# EAGLE design iRepair (EAGLE 7.3.0)
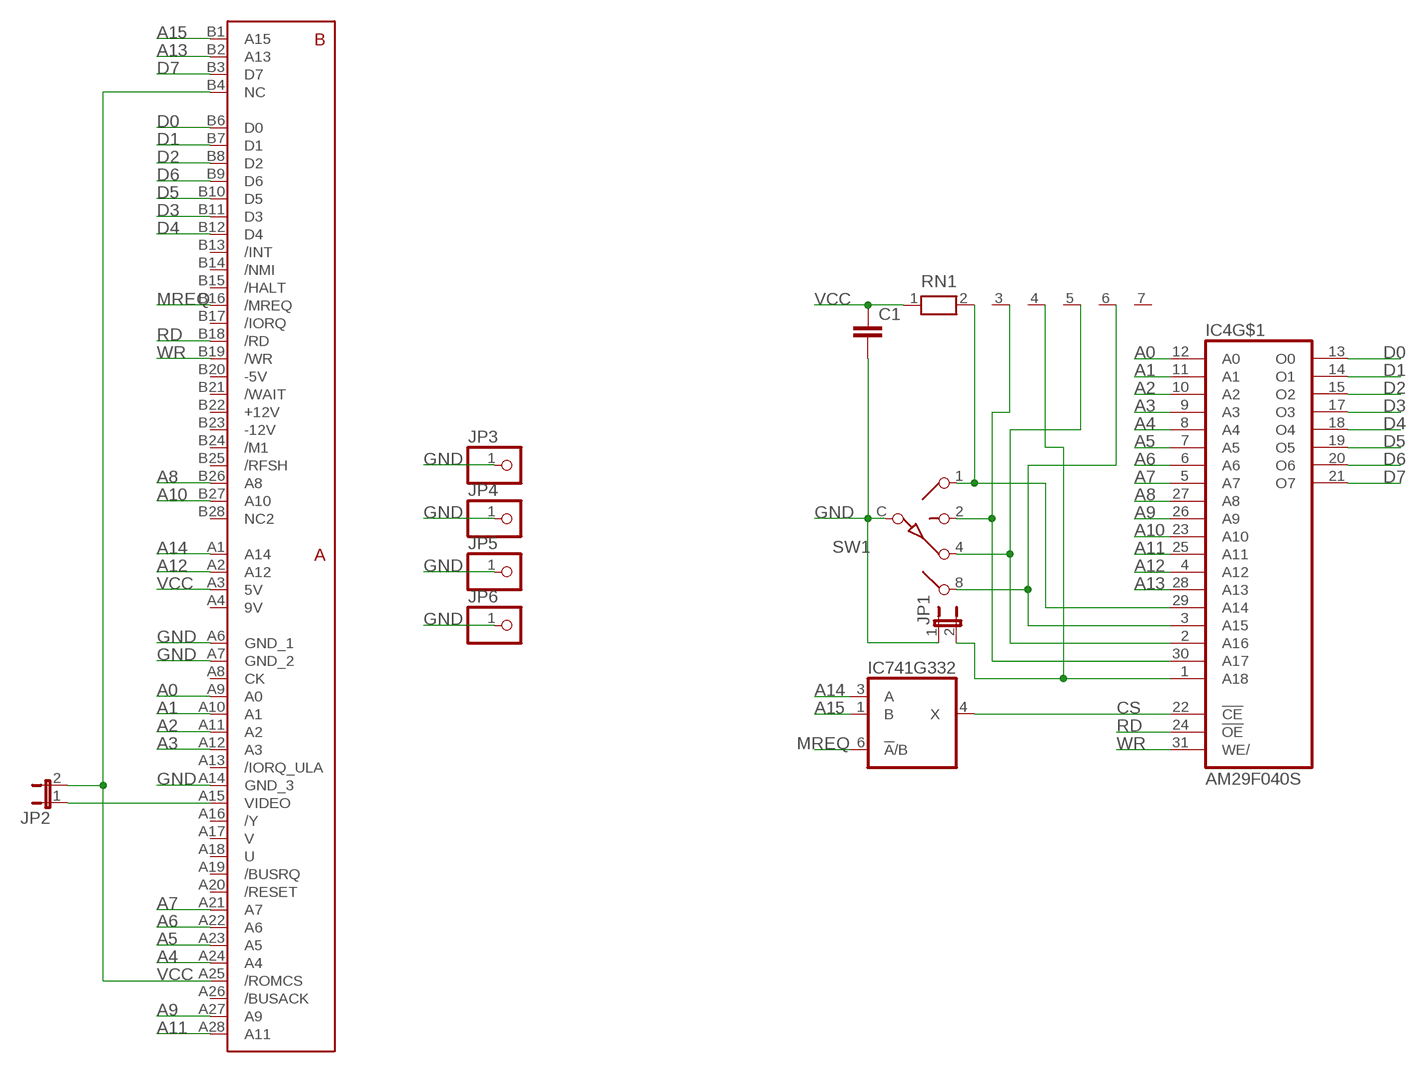
[diagram p0: schematic, sheet 1]

## Parts
C1  C-EU025-025X050  [C025-025X050]
IC4  AM29F040S  [PLCC-SR32]
IC741G332  741G3157DBVR  [DBV_R-PDSO-G6]
JP1  JP1E  [JP1]
JP2  JP1E  [JP1]
JP3  PINHD-1X1  [1X01]
JP4  PINHD-1X1  [1X01]
JP5  PINHD-1X1  [1X01]
JP6  PINHD-1X1  [1X01]
RN1  RN06  [RN-7]
SW1  SW-C16  [SW-C16]
U$3  ZXSP_ED2X28_SPE  [2X28_SPE]

## Nets
A0: IC4.12(A0) U$3.A9(A0)
A1: IC4.11(A1) U$3.A10(A1)
A2: IC4.10(A2) U$3.A11(A2)
A3: IC4.9(A3) U$3.A12(A3)
A4: IC4.8(A4) U$3.A24(A4)
A5: IC4.7(A5) U$3.A23(A5)
A6: IC4.6(A6) U$3.A22(A6)
A7: IC4.5(A7) U$3.A21(A7)
A8: IC4.27(A8) U$3.B26(A8)
A9: IC4.26(A9) U$3.A27(A9)
A10: IC4.23(A10) U$3.B27(A10)
A11: IC4.25(A11) U$3.A28(A11)
A12: IC4.4(A12) U$3.A2(A12)
A13: IC4.28(A13) U$3.B2(A13)
A14: IC741G332.3(A) U$3.A1(A14)
A15: IC741G332.1(B) U$3.B1(A15)
CS: IC4.22(!CE) IC741G332.4(X)
D0: IC4.13(O0) U$3.B6(D0)
D1: IC4.14(O1) U$3.B7(D1)
D2: IC4.15(O2) U$3.B8(D2)
D3: IC4.17(O3) U$3.B11(D3)
D4: IC4.18(O4) U$3.B12(D4)
D5: IC4.19(O5) U$3.B10(D5)
D6: IC4.20(O6) U$3.B9(D6)
D7: IC4.21(O7) U$3.B3(D7)
GND: C1.2 JP1.1 JP3.1 JP4.1 JP5.1 JP6.1 SW1.C U$3.A6(GND_1) U$3.A7(GND_2) U$3.A14(GND_3)
MREQ: IC741G332.6(!A!/B) U$3.B16(/MREQ)
N$1: JP2.1 U$3.A15(VIDEO)
N$2: IC4.1(A18) JP1.2 RN1.4
N$3: IC4.30(A17) RN1.3 SW1.2
N$4: IC4.2(A16) RN1.5 SW1.4
N$5: IC4.3(A15) RN1.6 SW1.8
N$6: IC4.29(A14) RN1.2 SW1.1
RD: IC4.24(!OE) U$3.B18(/RD)
VCC: C1.1 JP2.2 RN1.1 U$3.A3(5V) U$3.A25(/ROMCS) U$3.B4(NC)
WR: IC4.31(WE/) U$3.B19(/WR)
Unconnected: RN1.7 U$3.A8(CK) U$3.A13(/IORQ_ULA) U$3.A16(/Y) U$3.A17(V) U$3.A18(U) U$3.A19(/BUSRQ) U$3.A20(/RESET) U$3.A26(/BUSACK) U$3.B13(/INT) U$3.B14(/NMI) U$3.B15(/HALT) U$3.B17(/IORQ) U$3.B21(/WAIT) U$3.B24(/M1) U$3.B25(/RFSH) U$3.B28(NC2)

## Power pins joined to a net without a drawn wire
9V: U$3.A4(9V)
+12V: U$3.B22(+12V)
-5V: U$3.B20(-5V)
-12V: U$3.B23(-12V)
GND: IC4.16(GND) IC741G332.2(GND)
VCC: IC4.32(VCC) IC741G332.5(VCC)

## Library data of the parts
C1 = rcl:C-EU: CAPACITOR, European symbol
IC4 = am29-memory:AM29F040S
IC741G332 = 74xx-little-de:74*1G3157: Single-Pole, Double-Throw Analog Switch Source: http://focus.ti.com/lit/ds/symlink/sn74lvc1g3157.pdf
JP1 JP2 = jumper:JP1E: JUMPER
JP3-JP6 = pinhead:PINHD-1X1: PIN HEADER
RN1 = resistor-net:RN06: RESISTOR NETWORK; OC_FARNELL: unknown; OC_NEWARK: unknown
SW1 = special:SW-C16: SWITCH 16-step rotary switch
U$3 = zx_edge:ZXSP_ED

## Board
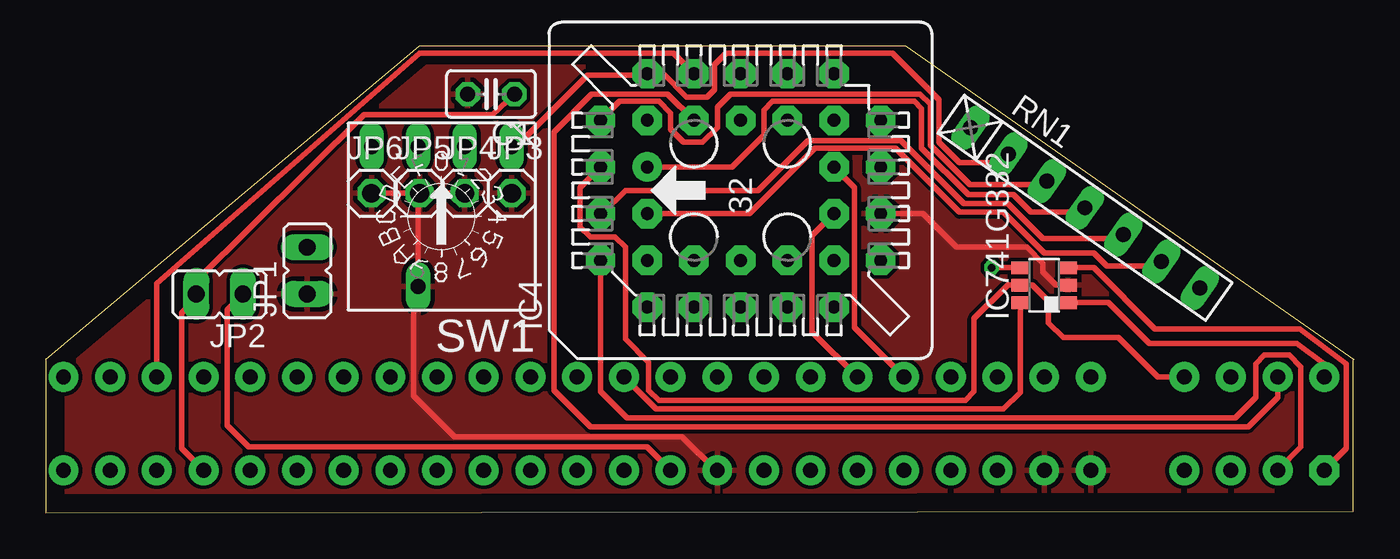
[diagram p1: board, top side]
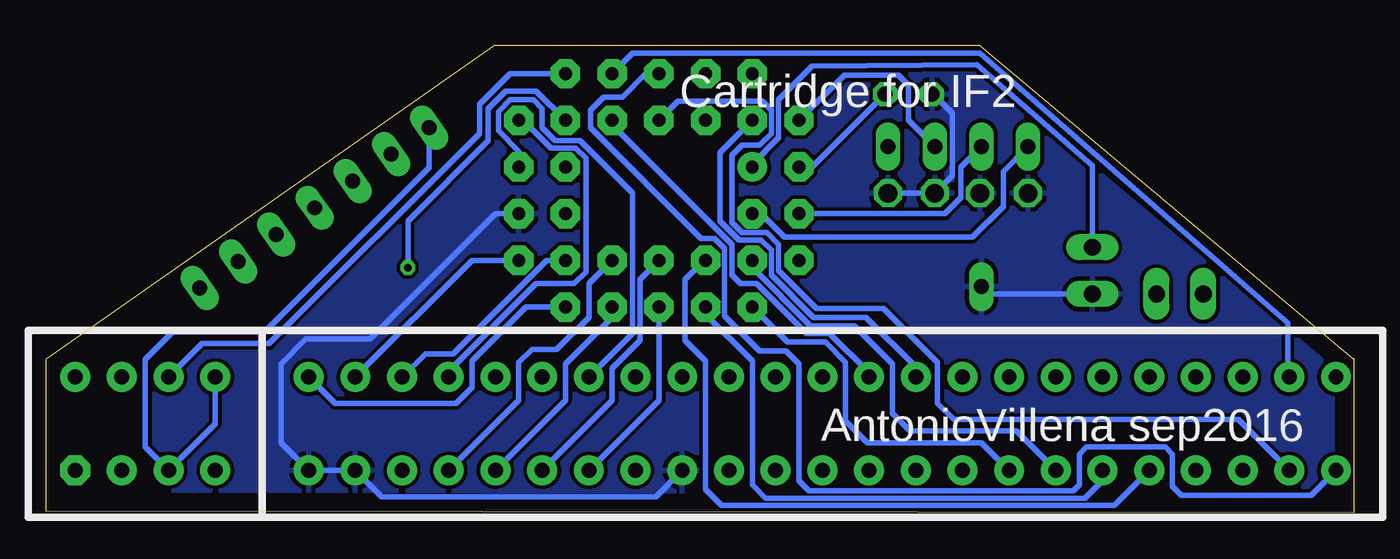
[diagram p2: board, bottom side, seen from below]

Size 71.12 x 25.4 mm. Coordinates in mm from the lower left corner, seen from the top.
Outline: 71.1,8.32 71.1,0.08 0,0 0,8.33
Outline: 0,8.4 0,8.33
Outline: 0,8.33 20.32,25.4 46.75,25.4 71.12,8.33
Copper layers (1*16): Top 0.035mm / dielectric 1.5mm / Bottom 0.035mm
Design rules "default": minimum track width 10mil, minimum drill 24mil, track to track 8mil, track to pad 8mil, pad to pad 8mil, via to via 8mil, smd to smd 8mil, copper to edge 40mil, drill to drill 8mil, minimum pad ring 10mil, minimum via ring 8mil, stop-mask expansion 4mil, vias tented up to drill 0mil, thermal gap 10mil

### Footprints (pad centres in the part's own frame; a part is rotated, then mirrored left to right if it is on the bottom)
C025-025X050 = drill 0.813 octagon: 1 -1.27,0; 2 1.27,0
PLCC-SR32 = drill 0.7 pad 1.6: 1 1.27,5.08 | drill 0.7 pad 1.6 octagon: 2 -1.27,7.62; 3 -1.27,5.08; 4 -3.81,7.62; 5 -6.35,5.08; 6 -3.81,5.08; 7 -6.35,2.54; 8 -3.81,2.54; 9 -6.35,0; 10 -3.81,0; 11 -6.35,-2.54; 12 -3.81,-2.54; 13 -6.35,-5.08; 14 -3.81,-7.62; 15 -3.81,-5.08; 16 -1.27,-7.62; 17 -1.27,-5.08; 18 1.27,-7.62; 19 1.27,-5.08; 20 3.81,-7.62; 21 6.35,-5.08; 22 3.81,-5.08; 23 6.35,-2.54; 24 3.81,-2.54; 25 6.35,0; 26 3.81,0; 27 6.35,2.54; 28 3.81,2.54; 29 6.35,5.08; 30 3.81,7.62; 31 3.81,5.08; 32 1.27,7.62
DBV_R-PDSO-G6 = smd 0.69 x 0.99: 1 -0.95,-1.29; 2 0,-1.29; 3 0.95,-1.29; 4 0.95,1.3; 5 0,1.3; 6 -0.95,1.3
JP1 = drill 0.914 long: 1 0,-1.27; 2 0,1.27
1X01 = drill 1.016 octagon: 1 0,0
RN-7 = drill 0.813 long: 1 -7.62,0; 2 -5.08,0; 3 -2.54,0; 4 0,0; 5 2.54,0; 6 5.08,0; 7 7.62,0
SW-C16 = drill 0.813 long: 1 -3.81,-3.81; 2 -1.27,-3.81; 4 1.27,-3.81; 8 3.81,-3.81; C 1.27,3.81
2X28_SPE = drill 0.813 pad 1.626 octagon: A1 0,-5.08 | drill 0.813 pad 1.626: A2 2.54,-5.08; A3 5.08,-5.08; A4 7.62,-5.08; A6 12.7,-5.08; A7 15.24,-5.08; A8 17.78,-5.08; A9 20.32,-5.08; A10 22.86,-5.08; A11 25.4,-5.08; A12 27.94,-5.08; A13 30.48,-5.08; A14 33.02,-5.08; A15 35.56,-5.08; A16 38.1,-5.08; A17 40.64,-5.08; A18 43.18,-5.08; A19 45.72,-5.08; A20 48.26,-5.08; A21 50.8,-5.08; A22 53.34,-5.08; A23 55.88,-5.08; A24 58.42,-5.08; A25 60.96,-5.08; A26 63.5,-5.08; A27 66.04,-5.08; A28 68.58,-5.08; B1 0,0; B2 2.54,0; B3 5.08,0; B4 7.62,0; B6 12.7,0; B7 15.24,0; B8 17.78,0; B9 20.32,0; B10 22.86,0; B11 25.4,0; B12 27.94,0; B13 30.48,0; B14 33.02,0; B15 35.56,0; B16 38.1,0; B17 40.64,0; B18 43.18,0; B19 45.72,0; B20 48.26,0; B21 50.8,0; B22 53.34,0; B23 55.88,0; B24 58.42,0; B25 60.96,0; B26 63.5,0; B27 66.04,0; B28 68.58,0

### Placement (x,y rotation side)
C1  24.21,22.78 180 top
IC4  37.78,17.54 90 top
IC741G332  54.29,12.38 90 top
JP1  14.21,13.18 0 top
JP2  9.45,11.91 90 top
JP3  25.32,17.38 0 top
JP4  22.78,17.38 0 top
JP5  20.32,17.38 0 top
JP6  17.7,17.38 0 top
RN1  56.52,16.59 325 top
SW1  21.51,16.11 180 top
U$3  69.53,7.38 0 bottom

### Tracks (layer width: path | path; a pad name or v marks a point on that pad's centre or on a via)
A0
  Bottom 0.305: IC4.12 41.59,12.46 41.59,10.64 43.34,8.89 44.69,8.89 45.4,8.18 45.4,6.11 U$3.A9
A1
  Bottom 0.305: IC4.11 40.32,10.64 42.86,8.1 42.86,6.11 U$3.A10
A2
  Bottom 0.305: IC4.10 38.81,12.7 38.81,9.37 40.32,7.86 40.32,6.11 U$3.A11
A3
  Bottom 0.305: IC4.9 37.78,6.11 U$3.A12
A4
  Bottom 0.305: IC4.8 35.32,13.73 36.35,12.7 36.35,9.37 35.24,8.26 35.24,1.27 34.37,0.4 13.02,0.4 U$3.A24
A5
  Bottom 0.305: IC4.7 35.24,10.79 32.7,8.26 32.7,1.51 31.99,0.79 14.61,0.79 13.65,1.75 U$3.A23
A6
  Bottom 0.305: IC4.6 32.7,13.34 29.53,10.16 27.15,10.16 25.08,8.1 25.08,5.4 24.13,4.45 18.34,4.45 U$3.A22
A7
  Bottom 0.305: U$3.A21 20.24,3.81 26.43,3.81 27.62,5 27.62,8.18 28.73,9.29 30.8,9.29 IC4.5
A8
  Top 0.305: IC4.27 34.13,25 20.32,25 6.03,12.46 U$3.B26
A9
  Bottom 0.305: IC4.26 36.75,22.38 32.15,22.38 31.67,21.91 31.67,20.64 32.31,20 33.26,20 33.81,19.45 33.81,15.8 33.26,15.24 31.91,15.24 31.27,14.61 31.27,13.18 29.21,11.11 25.56,11.11 22.62,8.18 22.62,5.95 21.75,5.08 6.27,5.08 U$3.A27
A10
  Bottom 0.305: IC4.23 39.21,25 20.32,25 3.57,10.32 3.57,7.46 U$3.B27
A11
  Bottom 0.305: IC4.25 38.5,23.89 39.77,22.62 40.8,22.62 41.51,21.91 41.51,20.95 35.48,14.92 34.77,14.92 34.21,14.37 34.21,10.72 32.31,8.81 30.88,8.81 30.16,8.1 30.16,1.75 29.61,1.19 15.24,1.19 14.92,1.51 14.92,3.17 14.53,3.57 10.24,3.57 9.84,3.17 9.84,1.43 9.37,0.95 2.3,0.95 U$3.A28
A12
  Top 0.305: IC4.4 30.16,6.59 31.59,5.16 64.69,5.16 65.8,6.27 65.8,8.1 66.28,8.57 67.63,8.57 68.26,7.94 68.26,3.57 U$3.A2
A13
  Top 0.305: IC4.28 33.81,22.78 29.69,22.78 27.62,20.72 27.62,6.67 29.61,4.68 65.41,4.68 66.99,6.27 U$3.B2
A14
  Top 0.305: IC741G332.3 56.99,13.33 60.33,10 68.18,10 70.72,8.1 70.72,3.49 U$3.A1
A15
  Top 0.305: IC741G332.1 57.78,11.43 60.01,9.21 68.02,9.21 69.53,8.1 U$3.B1
CS  (via drill 0.4)
  Top 0.305: v51.44,13.34 IC741G332.4
  Bottom 0.305: IC4.22 44.45,22.94 46.12,22.94 47.07,21.99 47.07,20.24 51.44,15.88 v51.44,13.34
D0
  Bottom 0.305: IC4.13 45.01,11.19 47.94,8.26 47.94,6.83 48.82,5.95 55.4,5.95 U$3.B6
D1
  Bottom 0.305: IC4.14 47.94,13.73 U$3.B7
D2
  Bottom 0.305: IC4.15 43.89,13.73 48.97,8.65 50.48,8.65 U$3.B8
D3
  Top 0.305: U$3.B11 41.67,9.84 41.67,15.08 IC4.17
D4
  Bottom 0.305: IC4.18 45.4,19.68 46.51,20.8 46.51,21.83 45.88,22.46 44.61,22.46 44.13,21.99 44.13,20.95 43.42,20.24 42.07,20.24 39.21,17.38 39.21,9.76 U$3.B12
D5
  Top 0.305: IC4.19 43.97,17.7 43.97,10.08 U$3.B10
D6
  Bottom 0.305: IC4.20 45.16,21.35 43.66,19.84 42.31,19.84 41.75,19.29 41.75,13.1 42.39,12.46 44.45,12.46 49.21,7.7 U$3.B9
D7
  Bottom 0.305: IC4.21 45.88,23.89 47.55,22.23 47.55,20.64 58.98,9.21 62.63,9.21 U$3.B3
GND
  Top 0.305: JP5.1 20.24,17.3 SW1.C 20,12.06 20,6.35 22.23,4.13 34.61,4.13 36.43,2.3 U$3.A14 | JP5.1 JP6.1 | JP5.1 JP4.1 | IC741G332.2 54.93,12.38 54.21,13.1 54.21,13.57 53.34,14.45 49.53,14.45 47.7,16.27 IC4.16
  Bottom 0.305: U$3.A14 37.94,0.87 52.86,0.87 U$3.A7 U$3.A6 58.34,3.81 58.34,8.1 56.99,9.45 53.5,9.45 46.67,16.27 IC4.16 | JP3.1 JP4.1 21.83,18.34 21.83,21.75 22.86,22.78 C1.2 | JP1.1 19.84,11.91 SW1.C
  pour Bottom: 0.32,8.18 20.48,25.08 46.59,25.08 46.59,25 70.88,8.02 70.96,0.32 0.4,0.32
  pour Top: 0.64,8.26 20.48,25 46.75,24.92 70.8,8.02 70.8,0.32 0.32,0.32 0.32,8.02
MREQ
  Top 0.305: IC741G332.6 52.99,6.56 52.07,5.64 33.18,5.64 U$3.B16
N$1
  Top 0.305: JP2.1 9.84,11.03 9.84,4.76 11.03,3.57 32.7,3.57 U$3.A15
N$2
  Top 0.305: IC4.1 37.31,18.81 39.05,20.56 39.05,21.91 39.53,22.38 47.23,22.38 47.62,21.99 47.62,19.84 50.16,17.3 52.63,17.3 53.58,16.35 56.28,16.35 RN1.4
  Bottom 0.305: IC4.1 32.7,18.97 31.27,20.4 31.27,22.46 29.45,24.29 20.48,24.37 14.21,18.89 JP1.2
N$3
  Top 0.305: IC4.30 31.19,22.38 33.34,22.38 33.97,21.75 33.97,20.88 34.69,20.16 35.72,20.16 36.51,20.95 36.51,22.07 37.23,22.78 47.55,22.78 48.1,22.23 48.1,20 50.24,17.86 54.25,17.86 RN1.3
  Bottom 0.305: IC4.30 27.7,23.81 24.77,23.81 24.21,23.26 24.21,21.35 SW1.2
N$4
  Top 0.305: IC4.2 30.24,16.27 31.51,17.54 38.73,17.54 41.43,20.24 46.51,20.24 49.93,16.83 52.31,16.83 54.21,14.92 58.39,14.92 RN1.5
  Bottom 0.305: IC4.2 22.23,16.27 21.35,17.14 21.35,18.81 SW1.4
N$5
  Top 0.305: IC4.3 38.26,16.27 41.83,19.84 46.2,19.84 49.69,16.35 52.07,16.35 54.29,14.13 56.99,14.13 57.71,13.41 60.41,13.41 RN1.6
  Bottom 0.305: IC4.3 32.23,16.27 30.96,15 20.72,15 19.05,16.67 19.05,18.57 SW1.8
N$6
  Top 0.305: SW1.1 25.56,19.92 29.45,23.81 32.62,23.81 IC4.29 33.58,23.89 34.85,22.62 35.96,22.62 36.35,23.02 36.35,24.37 36.99,25 46.04,25 48.58,22.46 48.58,20.16 49.69,19.05 51.9,19.05 RN1.2
RD
  Bottom 0.305: IC4.24 40.32,21.11 33.81,14.61 33.81,12.94 33.34,12.46 32.46,12.46 29.77,9.76 28.5,9.76 26.35,7.62 U$3.B18
VCC
  Top 0.305: C1.1 24.29,21.67 17.3,21.67 8.18,12.62 JP2.2 8.18,11.67 7.38,10.87 7.38,3.49 U$3.A25 | U$3.B4 60.48,7.38 58.34,9.53 55.32,9.53 54.53,10.32 54.53,11.51 53.66,12.38 IC741G332.5 52.31,12.38 50.48,10.56 50.48,6.59 50.01,6.11 33.34,6.11 32.78,6.67 32.78,8.18 31.51,9.45 31.51,14.45 30.96,15 29.61,15 29.05,15.56 29.05,17.7 IC4.32
  Bottom 0.305: IC4.32 29.45,18.81 C1.1 | RN1.1 50.27,18.78 59.21,9.84 64.21,9.84 65.72,8.33 65.72,3.57 U$3.A3 61.91,4.84 U$3.B4
WR
  Bottom 0.305: IC4.31 34.45,19.61 34.45,15.88 33.42,14.84 32.23,14.84 31.67,14.29 31.67,12.94 29.37,10.64 26.51,10.64 23.81,7.94 U$3.B19

### Text on the board
bPlace: Cartridge for IF2 | AntonioVillena sep2016